# EAGLE schematic DMX (EAGLE 7.4.0)
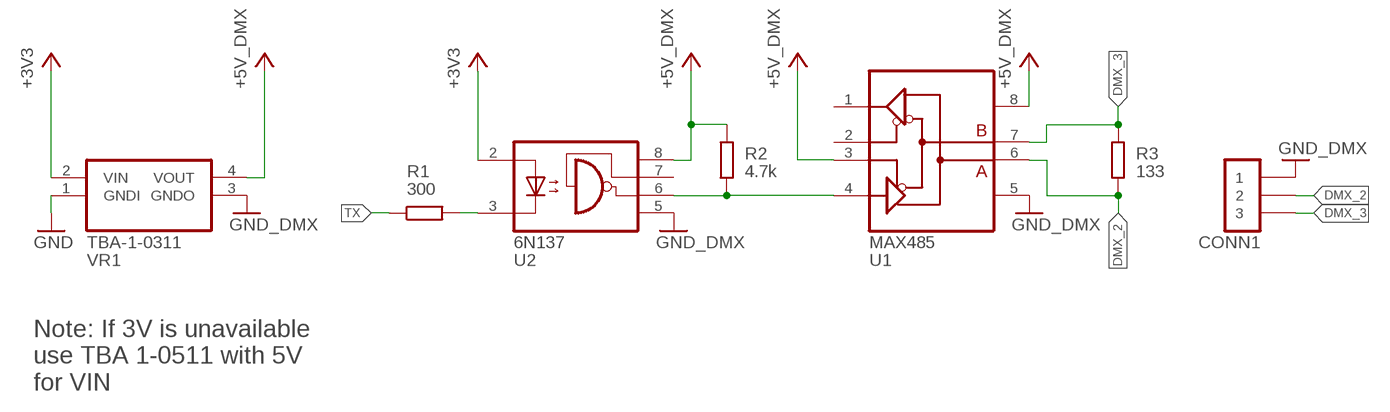
[diagram p0: schematic, sheet 1]

## Parts
CONN1  PINHD-1X03-TH-2.54MM  [1X03-2.54-V]
R1  300  RESISTOR-0805  [R0805]
R2  4.7k  RESISTOR-0805  [R0805]
R3  133  RESISTOR-0805  [R0805]
U1  MAX485  [DIL08]
U2  6N137  [DIL08]
VR1  TBA-1-0311  [TBA-1-0311]

## Nets
+3V3: U2.2(A) VR1.2(VIN)
+5V_DMX: R2.1 U1.3(DE) U1.8(VCC) U2.8(VCC) VR1.4(VOUT)
DMX_2: CONN1.2 R3.2 U1.6(A)
DMX_3: CONN1.3 R3.1 U1.7(B)
GND: CONN1.1 VR1.1(GNDI) ; supply symbol labelled GND_DMX
GND_DMX: U1.5(GND) U2.5(GND) VR1.3(GNDO)
N$1: R2.2 U1.4(DI) U2.6(VO)
TX: R1.1
VCC: R1.2 U2.3(C)
Unconnected: U1.1(RO) U1.2(!RE) U2.7(VE)

## Notes on the sheet
- Note: If 3V is unavailable
  use TBA 1-0511 with 5V
  for VIN

## Library data of the parts
CONN1 = igor_lbr:PINHD-1X03: Pin Header
R1-R3 = igor_lbr:RESISTOR: Resistor
U1 = igor_lbr:MAX485: Low-Power, Slew-Rate-Limited RS-485/RS-422 Transceiver
U2 = igor_lbr:6N137: High Speed Optocoupler; MANUFACTURER: Vishay; MPN: 6N137
VR1 = igor_lbr:TBA-1-0311: Isolated DC/DC Converter